# EAGLE design datalogger (EAGLE 8.3.2)
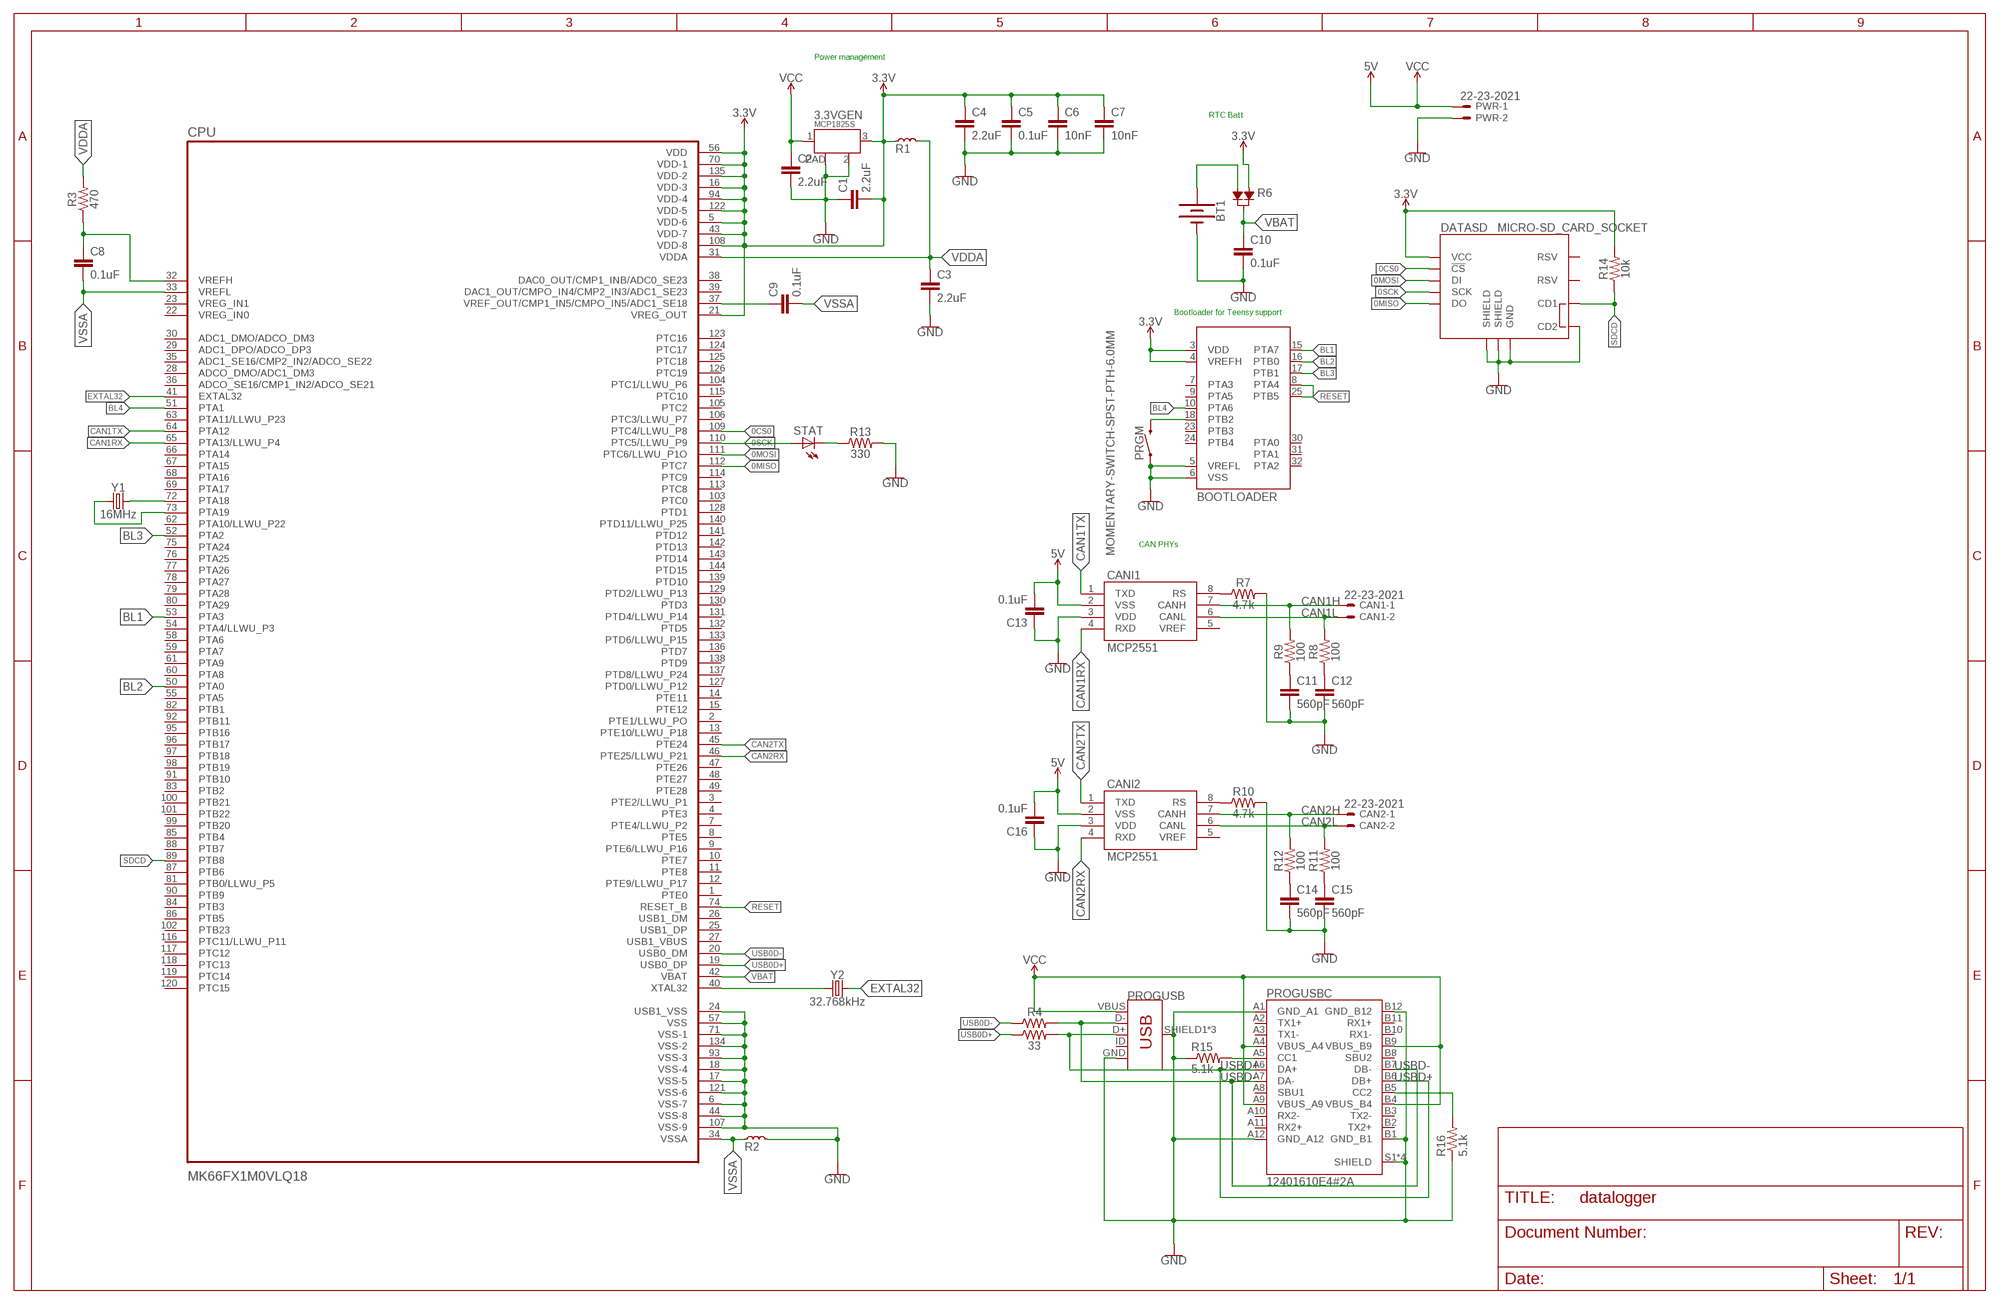
[diagram p0: schematic, sheet 1]

## Parts
3.3VGEN  MCP1825S  LDO  [SOT-223]
BOOTLOADER  MKL04Z32VLC4  [LQFP32-08]
BT1  BATTERY-20MM_SMD_4LEGS  [BATTCON_20MM_4LEGS]
C1  2.2uF  2.2UF-0603-10V-20%  [0603]
C2  2.2uF  2.2UF-0603-10V-20%  [0603]
C3  2.2uF  2.2UF-0603-10V-20%  [0603]
C4  2.2uF  2.2UF-0603-10V-20%  [0603]
C5  0.1uF  0.1UF-0603-25V-(+80/-20%)  [0603]
C6  10nF  10NF-0603-50V-10%  [0603]
C7  10nF  10NF-0603-50V-10%  [0603]
C8  0.1uF  0.1UF-0603-25V-(+80/-20%)  [0603]
C9  0.1uF  0.1UF-0603-25V-(+80/-20%)  [0603]
C10  0.1uF  0.1UF-0603-25V-(+80/-20%)  [0603]
C11  560pF  560PF-0603-50V-5%  [0603]
C12  560pF  560PF-0603-50V-5%  [0603]
C13  0.1uF  0.1UF-0603-25V-(+80/-20%)  [0603]
C14  560pF  560PF-0603-50V-5%  [0603]
C15  560pF  560PF-0603-50V-5%  [0603]
C16  0.1uF  0.1UF-0603-25V-(+80/-20%)  [0603]
CAN1  22-23-2021  [22-23-2021]
CAN2  22-23-2021  [22-23-2021]
CANI1  MCP2551  [SO08]
CANI2  MCP2551  [SO08]
CPU  MK66FX1M0VLQ18  [QFP50P2200X2200X160-144N]
DATASD  MICRO-SD_CARD_SOCKET  [MICRO-SD-SOCKET]
PRGM  MOMENTARY-SWITCH-SPST-PTH-6.0MM  [TACTILE_SWITCH_PTH_6.0MM]
PROGUSB  USB_MICRO-B_FEMALE-SMT  [USB-B-MICRO-SMD]
PROGUSBC  12401610E4#2A  [AMPHENOL_12401610E4#2A]
PWR  22-23-2021  [22-23-2021]
R1  FERRITE  [L0603]
R2  FERRITE  [L0603]
R3  470  470OHM-0603-1/10W-1%  [0603]
R4  33  33OHM-0603-1/10W-1%  [0603]
R5  33  33OHM-0603-1/10W-1%  [0603]
R6  DIODE_DUAL  [SOT-23]
R7  4.7k  4.7KOHM-0603-1/10W-1%  [0603]
R8  100  100OHM-0603-1/4W-5%  [0603]
R9  100  100OHM-0603-1/4W-5%  [0603]
R10  4.7k  4.7KOHM-0603-1/10W-1%  [0603]
R11  100  100OHM-0603-1/4W-5%  [0603]
R12  100  100OHM-0603-1/4W-5%  [0603]
R13  330  330OHM-0603-1/10W-1%  [0603]
R14  10k  10KOHM-0603-1/10W-1%  [0603]
R15  5.1k  R-US_R0603  [R0603]
R16  5.1k  R-US_R0603  [R0603]
STAT  LED5MM  [LED5MM]
Y1  16MHz  CRYSTAL-16MHZSMD-5X3.2  [CRYSTAL-SMD-5X3.2-4PAD]
Y2  32.768kHz  CRYSTAL-32.768KHZPTH-2X6  [CRYSTAL-PTH-2X6-CYL]

## Nets
0CS0: CPU.109(PTC4/LLWU_P8) DATASD.CS(!CS)
0MISO: CPU.112(PTC7) DATASD.DO
0MOSI: CPU.111(PTC6/LLWU_P1O) DATASD.DI
0SCK: CPU.110(PTC5/LLWU_P9) DATASD.SCLK(SCK) STAT.A
3.3V [THIC]: 3.3VGEN.3(OUT) BOOTLOADER.3(VDD) BOOTLOADER.4(VREFH) C1.2 C4.1 C5.1 C6.1 C7.1 CPU.5(VDD-6) CPU.16(VDD-3) CPU.21(VREG_OUT) CPU.43(VDD-7) CPU.56(VDD) CPU.70(VDD-1) CPU.94(VDD-4) CPU.108(VDD-8) CPU.122(VDD-5) CPU.135(VDD-2) DATASD.VCC R1.1 R6.2 R14.2
5V: C13.2 C16.2 CANI1.2(VSS) CANI2.2(VSS)
BL1: BOOTLOADER.15(PTA7) CPU.53(PTA3)
BL2: BOOTLOADER.16(PTB0) CPU.50(PTA0)
BL3: BOOTLOADER.17(PTB1) CPU.52(PTA2)
BL4: BOOTLOADER.10(PTA6) CPU.51(PTA1)
CAN1H: CAN1.1 CANI1.7(CANH) R9.2
CAN1L: CAN1.2 CANI1.6(CANL) R8.2
CAN1RX: CANI1.4(RXD) CPU.65(PTA13/LLWU_P4)
CAN1TX: CANI1.1(TXD) CPU.64(PTA12)
CAN2H: CAN2.1 CANI2.7(CANH) R12.2
CAN2L: CAN2.2 CANI2.6(CANL) R11.2
CAN2RX: CANI2.4(RXD) CPU.46(PTE25/LLWU_P21)
CAN2TX: CANI2.1(TXD) CPU.45(PTE24)
EXTAL32: CPU.41(EXTAL32) Y2.2
GND: 3.3VGEN.2(GND) 3.3VGEN.PAD BOOTLOADER.5(VREFL) BOOTLOADER.6(VSS) BT1.NEGATIVE(-) C1.1 C2.2 C3.2 C4.2 C5.2 C6.2 C7.2 C10.2 C11.2 C12.2 C13.1 C14.2 C15.2 C16.1 CANI1.3(VDD) CANI2.3(VDD) CPU.6(VSS-7) CPU.17(VSS-5) CPU.18(VSS-4) CPU.24(USB1_VSS) CPU.44(VSS-8) CPU.57(VSS) CPU.71(VSS-1) CPU.93(VSS-3) CPU.107(VSS-9) CPU.121(VSS-6) CPU.134(VSS-2) DATASD.CD2 DATASD.GND DATASD.GND1(SHIELD) DATASD.GND3(SHIELD) PRGM.1 PROGUSB.GND PROGUSB.SHIELD1(SHIELD) PROGUSB.SHIELD2(SHIELD) PROGUSB.SHIELD3(SHIELD) PROGUSBC.A1(GND_A1) PROGUSBC.A12(GND_A12) PROGUSBC.B1(GND_B1) PROGUSBC.B12(GND_B12) PROGUSBC.S1(SHIELD) PROGUSBC.S2(SHIELD) PROGUSBC.S3(SHIELD) PROGUSBC.S4(SHIELD) PWR.2 R2.2 R7.2 R10.2 R13.2 R15.1 R16.1
N$1: CPU.72(PTA18) Y1.3
N$2: CPU.73(PTA19) Y1.1
N$3: CPU.40(XTAL32) Y2.1
N$4: C9.1 CPU.37(VREF_OUT/CMP1_IN5/CMPO_IN5/ADC1_SE18)
N$8: R13.1 STAT.K(C)
N$9: PROGUSBC.A5(CC1) R15.2
N$10: BT1.POSITIVE@1(+) BT1.POSITIVE@2(+) BT1.POSITIVE@3(+) BT1.POSITIVE@4(+) R6.1
N$11: PROGUSBC.B5(CC2) R16.2
N$12: CANI1.8(RS) R7.1
N$13: C11.1 R9.1
N$14: C12.1 R8.1
N$19: CANI2.8(RS) R10.1
N$20: C14.1 R12.1
N$21: C15.1 R11.1
PRGM: BOOTLOADER.18(PTB2) PRGM.3
RESET: BOOTLOADER.8(PTA4) BOOTLOADER.25(PTB5) CPU.74(RESET_B)
SDCD: CPU.89(PTB8) DATASD.CD1 R14.1
USB0D+: CPU.19(USB0_DP) R5.1
USB0D-: CPU.20(USB0_DM) R4.1
USBD+: PROGUSB.D+ PROGUSBC.A6(DA+) PROGUSBC.B6(DB+) R5.2
USBD-: PROGUSB.D- PROGUSBC.A7(DA-) PROGUSBC.B7(DB-) R4.2
VBAT: C10.1 CPU.42(VBAT) R6.3
VCC: 3.3VGEN.1(IN) C2.1 PROGUSB.VBUS PROGUSBC.A4(VBUS_A4) PROGUSBC.A9(VBUS_A9) PROGUSBC.B4(VBUS_B4) PROGUSBC.B9(VBUS_B9) PWR.1 ; supply symbol labelled 5V
VDDA: C3.1 CPU.31(VDDA) R1.2 R3.2
VREFH: C8.1 CPU.32(VREFH) R3.1
VSSA: C8.2 C9.2 CPU.33(VREFL) CPU.34(VSSA) R2.1
Unconnected: BOOTLOADER.7(PTA3) BOOTLOADER.9(PTA5) BOOTLOADER.23(PTB3) BOOTLOADER.24(PTB4) BOOTLOADER.30(PTA0) BOOTLOADER.31(PTA1) BOOTLOADER.32(PTA2) CANI1.5(VREF) CANI2.5(VREF) CPU.1(PTE0) CPU.2(PTE1/LLWU_PO) CPU.3(PTE2/LLWU_P1) CPU.4(PTE3) CPU.7(PTE4/LLWU_P2) CPU.8(PTE5) CPU.9(PTE6/LLWU_P16) CPU.10(PTE7) CPU.11(PTE8) CPU.12(PTE9/LLWU_P17) CPU.13(PTE10/LLWU_P18) CPU.14(PTE11) CPU.15(PTE12) CPU.22(VREG_IN0) CPU.23(VREG_IN1) CPU.25(USB1_DP) CPU.26(USB1_DM) CPU.27(USB1_VBUS) CPU.28(ADCO_DMO/ADC1_DM3) CPU.29(ADC1_DPO/ADCO_DP3) CPU.30(ADC1_DMO/ADCO_DM3) CPU.35(ADC1_SE16/CMP2_IN2/ADCO_SE22) CPU.36(ADCO_SE16/CMP1_IN2/ADCO_SE21) CPU.38(DAC0_OUT/CMP1_INB/ADC0_SE23) CPU.39(DAC1_OUT/CMPO_IN4/CMP2_IN3/ADC1_SE23) CPU.47(PTE26) CPU.48(PTE27) CPU.49(PTE28) CPU.54(PTA4/LLWU_P3) CPU.55(PTA5) CPU.58(PTA6) CPU.59(PTA7) CPU.60(PTA8) CPU.61(PTA9) CPU.62(PTA10/LLWU_P22) CPU.63(PTA11/LLWU_P23) CPU.66(PTA14) CPU.67(PTA15) CPU.68(PTA16) CPU.69(PTA17) CPU.75(PTA24) CPU.76(PTA25) CPU.77(PTA26) CPU.78(PTA27) CPU.79(PTA28) CPU.80(PTA29) CPU.81(PTB0/LLWU_P5) CPU.82(PTB1) CPU.83(PTB2) CPU.84(PTB3) CPU.85(PTB4) CPU.86(PTB5) CPU.87(PTB6) CPU.88(PTB7) CPU.90(PTB9) CPU.91(PTB10) CPU.92(PTB11) CPU.95(PTB16) CPU.96(PTB17) CPU.97(PTB18) CPU.98(PTB19) CPU.99(PTB20) CPU.100(PTB21) CPU.101(PTB22) CPU.102(PTB23) CPU.103(PTC0) CPU.104(PTC1/LLWU_P6) CPU.105(PTC2) CPU.106(PTC3/LLWU_P7) CPU.113(PTC8) CPU.114(PTC9) CPU.115(PTC10) CPU.116(PTC11/LLWU_P11) CPU.117(PTC12) CPU.118(PTC13) CPU.119(PTC14) CPU.120(PTC15) CPU.123(PTC16) CPU.124(PTC17) CPU.125(PTC18) CPU.126(PTC19) CPU.127(PTD0/LLWU_P12) CPU.128(PTD1) CPU.129(PTD2/LLWU_P13) CPU.130(PTD3) CPU.131(PTD4/LLWU_P14) CPU.132(PTD5) CPU.133(PTD6/LLWU_P15) CPU.136(PTD7) CPU.137(PTD8/LLWU_P24) CPU.138(PTD9) CPU.139(PTD10) CPU.140(PTD11/LLWU_P25) CPU.141(PTD12) CPU.142(PTD13) CPU.143(PTD14) CPU.144(PTD15) DATASD.RSV1(RSV) DATASD.RSV2(RSV) PROGUSB.ID PROGUSBC.A2(TX1+) PROGUSBC.A3(TX1-) PROGUSBC.A8(SBU1) PROGUSBC.A10(RX2-) PROGUSBC.A11(RX2+) PROGUSBC.B2(TX2+) PROGUSBC.B3(TX2-) PROGUSBC.B8(SBU2) PROGUSBC.B10(RX1-) PROGUSBC.B11(RX1+)

## Notes on the sheet
- Power management
- RTC Batt
- Bootloader for Teensy support
- CAN PHYs

## Library data of the parts
3.3VGEN = t32_ref:LDO; DESC: 3.3V 500mA; MF: Microchip Technology; MPN: MCP1825S-3302E/DB; OC_MOUSER: 579-MCP1825S-3302EDB; PACKAGE: SOT-223-3; TYPE: Voltage regulator
BOOTLOADER = t32_ref:MKL04Z32VLC4; DESC: MKL04Z32VLC4 (preprogrammed); MF: PJRC; MPN: IC_MKL04Z32_TQFP32; PACKAGE: LQFP-32; TYPE: Microcontroller
BT1 = SparkFun-Batteries:BATTERY: Battery - Single Cell A variety of battery chemistries, sizes, and footprints. Device List: 20MM_PTH - Coin Cell Battery Holder - 20mm (PTH) <https://www.sparkfun.com/products/783> 6.8MM_PTH - Coin Cell Battery Holder - 6.8MM(SMD) <https://www.digikey.com/product-detail/en/seiko-instruments/MS621FE-FL11E/728-1057-ND/1889208?WT.srch=1&gclid=CNOQ5a6LzdQCFZS2wAodXCkE0g> 12MM_SMD - Coin Cell Battery Holder - 12mm (SMD) <https://www.sparkfun.com/products/10592> 12MM_PTH - Coin Cell Battery Holder - 12mm (PTH) <https://www.sparkfun.com/products/7948> 20MM_SMD - 20mm Coin Cell Battery Holder (SMD) (2 legs) Used on the Big Time Watch Kit <https://www.sparkfun.com/products/11734> 20MM_SMD_4LEGS - Coin Cell Battery Holder - 20mm (SMD) <https://www.sparkfun.com/products/11892> 20MM_SMD_4LEGS_OVERPASTE - Coin Cell Battery Holder - 20mm (SMD) <https://www.sparkfun.com/products/11892> (Over-paste on the legs) 24.5MM_PTH - Coin Cell Battery Holder - 24.5mm (PTH) <https://www.sparkfun.com/products/8863> 9V - 9V Battery Holder - PC Mount Used on the SparkFun SparkPunk Sound Kit <https://www.sparkfun.com/products/11177> and SparkFun SparkPunk Sequencer Kit <https://www.sparkfun.com/products/12707> 18650 - Battery Holder - 18650 (PTH) <https://www.sparkfun.com/products/13113> AA - Battery Holder - 1xAA (PTH) <https://www.sparkfun.com/products/7949> AAA - Battery Holder - 1xAAA (PTH) <https://www.sparkfun.com/products/12718> AA_KIT - Battery Holder - 1xAA (PTH) <https://www.sparkfun.com/products/7949> Special kit package - pads only have exposed copper on one side of the board. AAA_KIT - Battery Holder - 1xAAA (PTH) <https://www.sparkfun.com/products/12718> Special kit package - pads only have exposed copper on one side of the board.; PROD_ID: BATT-10373; SF_SKU: PRT-11892
C1-C4 = SparkFun-Capacitors:2.2UF: 2.2µF ceramic capacitors A capacitor is a passive two-terminal electrical component used to store electrical energy temporarily in an electric field.; PROD_ID: CAP-07888
C5 C8-C10 C13 C16 = SparkFun-Capacitors:0.1UF: 0.1µF ceramic capacitors A capacitor is a passive two-terminal electrical component used to store electrical energy temporarily in an electric field.; PROD_ID: CAP-00810
C6 C7 = SparkFun-Capacitors:10NF: 0.01uF/10nF/10,000pF ceramic capacitors A capacitor is a passive two-terminal electrical component used to store electrical energy temporarily in an electric field. CAP-09321; PROD_ID: CAP-00867
C11 C12 C14 C15 = SparkFun-Capacitors:560PF: 0.56nF/560pF ceramic capacitors A capacitor is a passive two-terminal electrical component used to store electrical energy temporarily in an electric field.; PROD_ID: CAP-08749
CAN1 CAN2 PWR = con-molex:22-23-2021: .100" (2.54mm) Center Header - 2 Pin; MF: MOLEX; MPN: 22-23-2021; OC_FARNELL: 1462926; OC_NEWARK: 25C3832
CANI1 CANI2 = SparkFun-IC-Comms:MCP2551: MCP2551 High Speed CAN Transceiver High speed CAN transceiver Datasheet <http://www.sparkfun.com/datasheets/DevTools/Arduino/MCP2551.pdf> SparkFun Products CAN-BUS Shield <https://www.sparkfun.com/products/13262> (DEV-13262) SparkFun OBD-II UART <https://www.sparkfun.com/products/9555> (WIG-09555); PROD_ID: IC-09907
CPU = MK66FX1M0VLQ18:MK66FX1M0VLQ18: Kinetis K66: 180MHz Cortex-M4F MCU, 1.2MB Flash, 256KB SRAM, 2xUSB, Ethernet, 144-LQFP Operating Characteristics Parameter Value Core Type Arm Cortex-M4 Operating Frequency [Max (MHz)] 180 SRAM (kB) 256 Flash (kB) 1024 EEPROM (kB) 4 UART 6 SPI 3 <th data-dtmsubaction="Part Details: Operating Characteristics Section: I2C Link Click" data-dtmaction="Part Details: Operating Characteristics Section: I2C Link Click" data-content-subfinding="Operating Characteristics Section" class="dtmcustomrulelink"> I2C data-dtmsubaction="Part Details: Operating Characteristics Section: I2C Link Click" data-dtmaction="Part Details: Operating Characteristics Section: I2C Link Click" data-content-subfinding="Operating Characteristics Section" class="dtmcustomrulelink">4 <th data-dtmsubaction="Part Details: Operating Characteristics Section: I2S Link Click" data-dtmaction="Part Details: Operating Characteristics Section: I2S Link Click" data-content-subfinding="Operating Characteristics Section" class="dtmcustomrulelink"> I2S data-dtmsubaction="Part Details: Operating Characteristics Section: I2S Link Click" data-dtmaction="Part Details: Operating Characteristics Section: I2S Link Click" data-content-subfinding="Operating Characteristics Section" class="dtmcustomrulelink">1 USB Controllers 2 CAN 2 Ethernet 1 GPIO 100 ADC (16 bit) 2 DAC (12-bit) 2 16-bit PWM 24 16-bit Timer 25 32-bit Timer 4 Other analog blocks voltage reference Security CA, CRC, RNG Human Machine Interface touch system interface Supply voltage [min] (V) 1.71 Supply voltage [max] (V) 3.6 Ambient Operating Temperature (Min-Max) (℃) -40 to 105 Manufacturer <https://www.nxp.com/part/MK66FX1M0VLQ18>; MANUFACTURER: NXP USA; PACKAGE: QFP50P2200X2200X160-144N
DATASD = SparkFun-Connectors:MICRO-SD_CARD_SOCKET: microSD Socket for Transflash Push-push type µSD socket. tDoc lines correctly indicate media card edge positions when inserting (unlocked, locked, depressed). NOTE: CD1 and CD2 are connected internally, and the default detect state of the socket is detect pin to ground. SparkFun Products: WAV Trigger <https://www.sparkfun.com/products/13660> CAN-Bus Shield <https://www.sparkfun.com/products/13262> SparkFun Level Shifing microSD Breakout <https://www.sparkfun.com/products/13743>; PROD_ID: CONN-07820; SF_ID: PRT-00127
PRGM = SparkFun-Switches:MOMENTARY-SWITCH-SPST: Momentary Switch (Pushbutton) - SPST Normally-open (NO) SPST momentary switches (buttons, pushbuttons). Variants PTH-12MM - 12mm square, through-hole Momentary Pushbutton Switch - 12mm Square <https://www.sparkfun.com/products/9190> (COM-09190) PTH-6.0MM, PTH-6.0MM-KIT - 6.0mm square, through-hole Mini Pushbutton Switch <https://www.sparkfun.com/products/97> (COM-00097) KIT package intended for soldering kit's - only one side of pads' copper is exposed. PTH-RIGHT-ANGLE-KIT - Right-angle, through-hole Right Angle Tactile Button <https://www.sparkfun.com/products/10791> - Used on SparkFun BigTime Watch Kit <https://www.sparkfun.com/products/11734> SMD-12MM - 12mm square, surface-mount Tactile Button - SMD (12mm) <https://www.sparkfun.com/products/12993> (COM-12993) Used on SparkFun PicoBoard <https://www.sparkfun.com/products/11888> SMD-4.5MM - 4.5mm Square Trackball Switch Used on SparkFun Blackberry Trackballer Breakout <https://www.sparkfun.com/products/13169> SMD-4.6MMX2.8MM - 4.60mm x 2.80mm, surface mount Used on SparkFun SAMD21 Mini Breakout <https://www.sparkfun.com/products/13664> SMD-5.2MM, SMD-5.2-REDUNDANT - 5.2mm square, surface-mount Mini Pushbutton Switch - SMD <https://www.sparkfun.com/products/8720> (COM-08720) Used on Arduino Pro Mini <https://www.sparkfun.com/products/11114> REDUNDANT package connects both switch circuits together SMD-6.0X3.5MM - 6.0 x 3.5mm, surface mount Momentary Reset Switch SMD <https://www.sparkfun.com/products/8229> (COM-08229) SMD-6.2MM-TALL - 6.2mm square, surface mount Tactile Button - SMD (6mm) <https://www.sparkfun.com/products/12992> Used on SparkFun Digital Sandbox <https://www.sparkfun.com/products/12651> SMD-RIGHT-ANGLE - Right-angle, surface mount Used on SparkFun Block for Intel® Edison - Arduino <https://www.sparkfun.com/products/13036>; PROD_ID: SWCH-08441; SF_SKU: COM-00097
PROGUSB = SparkFun-Connectors:USB_MICRO-B: USB Type Micro-B Connector Male/female and PTH/SMT variants SparkFun Products: SparkFun microB USB Breakout <https://www.sparkfun.com/products/12035> SparkFun USB microB Plug Breakout <https://www.sparkfun.com/products/10031> SparkFun ESP8266 Thing <https://www.sparkfun.com/products/13231>; PROD_ID: CONN-11752
PROGUSBC = 12401610E4_2A:12401610E4#2A: Usb Type-c, Ra Rcpt, Pcb Mount,; DESCRIPTION: Conn USB Type C Surface Mount Receptacle; DIGI-KEY_PART_NUMBER: 12401610E4#2ACT-ND; DIGI-KEY_PURCHASE_URL: https://www.digikey.com/product-detail/en/amphenol-icc-commercial-products/12401610E4-2A/12401610E4-2ACT-ND/5775520?utm_source=snapeda&utm_medium=aggregator&utm_campaign=symbol; MF: Amphenol ICC; MP: 12401610E4#2A; PACKAGE: None
R1 R2 = t32_ref:FERRITE; DESC: 600R / 100MHz; MF: Murata Electronics; MPN: BLM18AG601SN1D; OC_MOUSER: 81-BLM11A601S; PACKAGE: 0603; TYPE: Ferrite
R3 = SparkFun-Resistors:470OHM: 470Ω resistor A resistor is a passive two-terminal electrical component that implements electrical resistance as a circuit element. Resistors act to reduce current flow, and, at the same time, act to lower voltage levels within circuits. - Wikipedia; PROD_ID: RES-07869
R4 R5 = SparkFun-Resistors:33OHM: 33Ω resistor A resistor is a passive two-terminal electrical component that implements electrical resistance as a circuit element. Resistors act to reduce current flow, and, at the same time, act to lower voltage levels within circuits. - Wikipedia; PROD_ID: RES-08270
R6 = t32_ref:DIODE_DUAL; DESC: Dual Schottky, common cat; MF: NXP Semiconductors; MPN: BAT54C,215; OC_MOUSER: 771-BAT54C-T/R; PACKAGE: SOT-23; TYPE: Diode
R7 R10 = SparkFun-Resistors:4.7KOHM: 4.7kΩ resistor A resistor is a passive two-terminal electrical component that implements electrical resistance as a circuit element. Resistors act to reduce current flow, and, at the same time, act to lower voltage levels within circuits. - Wikipedia; PROD_ID: RES-07857
R8 R9 R11 R12 = SparkFun-Resistors:100OHM: 100Ω resistor A resistor is a passive two-terminal electrical component that implements electrical resistance as a circuit element. Resistors act to reduce current flow, and, at the same time, act to lower voltage levels within circuits. - Wikipedia; PROD_ID: RES-12438
R13 = SparkFun-Resistors:330OHM: 330Ω resistor A resistor is a passive two-terminal electrical component that implements electrical resistance as a circuit element. Resistors act to reduce current flow, and, at the same time, act to lower voltage levels within circuits. - Wikipedia; PROD_ID: RES-00818
R14 = SparkFun-Resistors:10KOHM: 10kΩ resistor A resistor is a passive two-terminal electrical component that implements electrical resistance as a circuit element. Resistors act to reduce current flow, and, at the same time, act to lower voltage levels within circuits. - Wikipedia; PROD_ID: RES-00824
R15 R16 = rcl:R-US_: RESISTOR, American symbol; SPICEPREFIX: R
STAT = led:LED: LED OSRAM: - CHIPLED LG R971, LG N971, LY N971, LG Q971, LY Q971, LO R971, LY R971 LH N974, LH R974 LS Q976, LO Q976, LY Q976 LO Q996 - Hyper CHIPLED LW Q18S LB Q993, LB Q99A, LB R99A - SideLED LS A670, LO A670, LY A670, LG A670, LP A670 LB A673, LV A673, LT A673, LW A673 LH A674 LY A675 LS A676, LA A676, LO A676, LY A676, LW A676 LS A679, LY A679, LG A679 - Hyper Micro SIDELED® LS Y876, LA Y876, LO Y876, LY Y876 LT Y87S - SmartLED LW L88C, LW L88S LB L89C, LB L89S, LG L890 LS L89K, LO L89K, LY L89K LS L896, LA L896, LO L896, LY L896 - TOPLED LS T670, LO T670, LY T670, LG T670, LP T670 LSG T670, LSP T670, LSY T670, LOP T670, LYG T670 LG T671, LOG T671, LSG T671 LB T673, LV T673, LT T673, LW T673 LH T674 LS T676, LA T676, LO T676, LY T676, LB T676, LH T676, LSB T676, LW T676 LB T67C, LV T67C, LT T67C, LS T67K, LO T67K, LY T67K, LW E67C LS E67B, LA E67B, LO E67B, LY E67B, LB E67C, LV E67C, LT E67C LW T67C LS T679, LY T679, LG T679 LS T770, LO T770, LY T770, LG T770, LP T770 LB T773, LV T773, LT T773, LW T773 LH T774 LS E675, LA E675, LY E675, LS T675 LS T776, LA T776, LO T776, LY T776, LB T776 LHGB T686 LT T68C, LB T68C - Hyper Mini TOPLED® LB M676 - Mini TOPLED Santana® LG M470 LS M47K, LO M47K, LY M47K Source: http://www.osram.convergy.de LUXEON: - LUMILED® LXK2-PW12-R00, LXK2-PW12-S00, LXK2-PW14-U00, LXK2-PW14-V00 LXK2-PM12-R00, LXK2-PM12-S00, LXK2-PM14-U00 LXK2-PE12-Q00, LXK2-PE12-R00, LXK2-PE12-S00, LXK2-PE14-T00, LXK2-PE14-U00 LXK2-PB12-K00, LXK2-PB12-L00, LXK2-PB12-M00, LXK2-PB14-N00, LXK2-PB14-P00, LXK2-PB14-Q00 LXK2-PR12-L00, LXK2-PR12-M00, LXK2-PR14-Q00, LXK2-PR14-R00 LXK2-PD12-Q00, LXK2-PD12-R00, LXK2-PD12-S00 LXK2-PH12-R00, LXK2-PH12-S00 LXK2-PL12-P00, LXK2-PL12-Q00, LXK2-PL12-R00 Source: www.luxeon.com KINGBRIGHT: KA-3528ASYC Source: www.kingbright.com
Y1 = SparkFun-Clocks:CRYSTAL-16MHZ: 16MHz Crystal Digikey Example <http://www.digikey.com/product-search/en?keywords=535-9122-1-ND> Frequency: 16MHz Frequency Stability: ±50ppm Frequency Tolerance: ±20ppm Load Capacitance: 18pF SparkFun Products: Pro Micro -5V/16MHz <https://www.sparkfun.com/products/12640> SparkFun Serial Enabled LCD Kit <https://www.sparkfun.com/products/10097>; PROD_ID: XTAL-08218; SF_ID: COM-00094
Y2 = SparkFun-Clocks:CRYSTAL-32.768KHZ: 32.768kHz Crystal Frequency: 32.768kHz Frequency Stability: ±20ppm Load Capacitance: 12.5pF (PTH-2X6 & SMD-3.2X1.5), 6pF (SMD-2X6) SparkFun Products: SparkFun BigTime Watch Kit <https://www.sparkfun.com/products/11734> SparkFun nRF52832 Breakout <https://www.sparkfun.com/products/13990> SparkFun Real Time Clock Module <https://www.sparkfun.com/products/12708>; PROD_ID: XTAL-10112

## Net classes
1 THICC: width 0.406 mm
2 THIC: width 0.279 mm

## Board
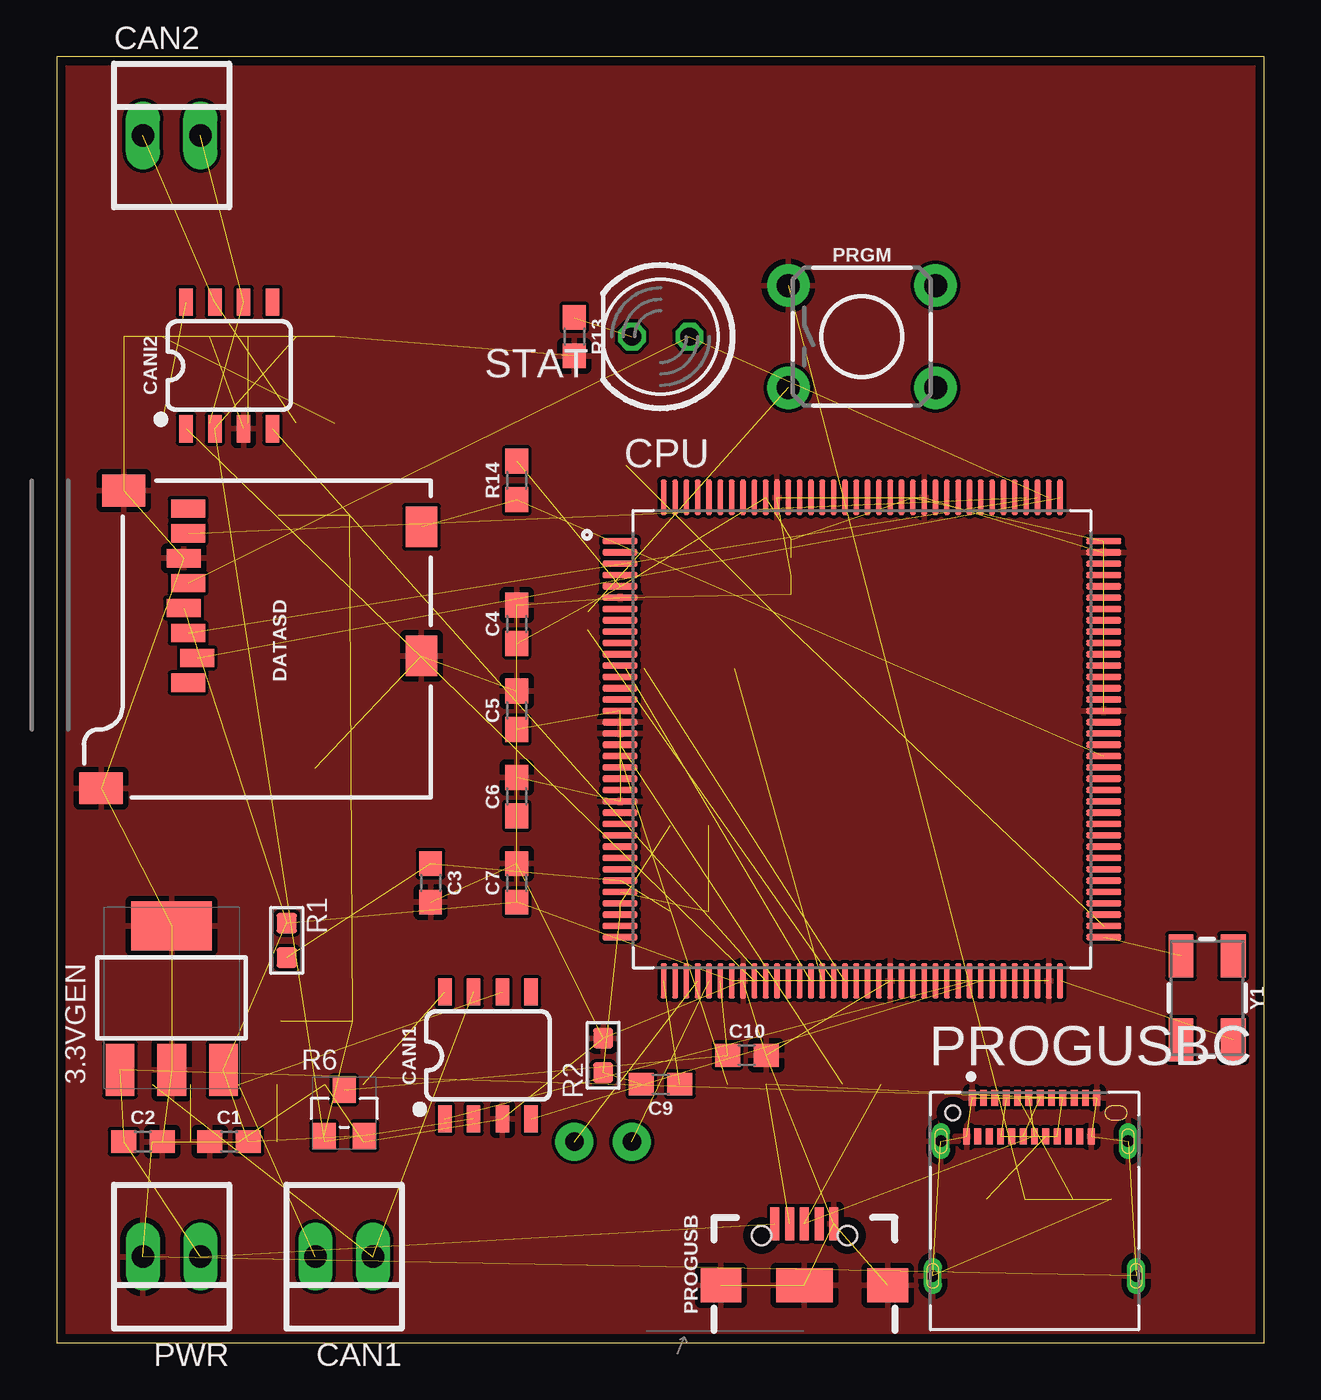
[diagram p1: board, top side]
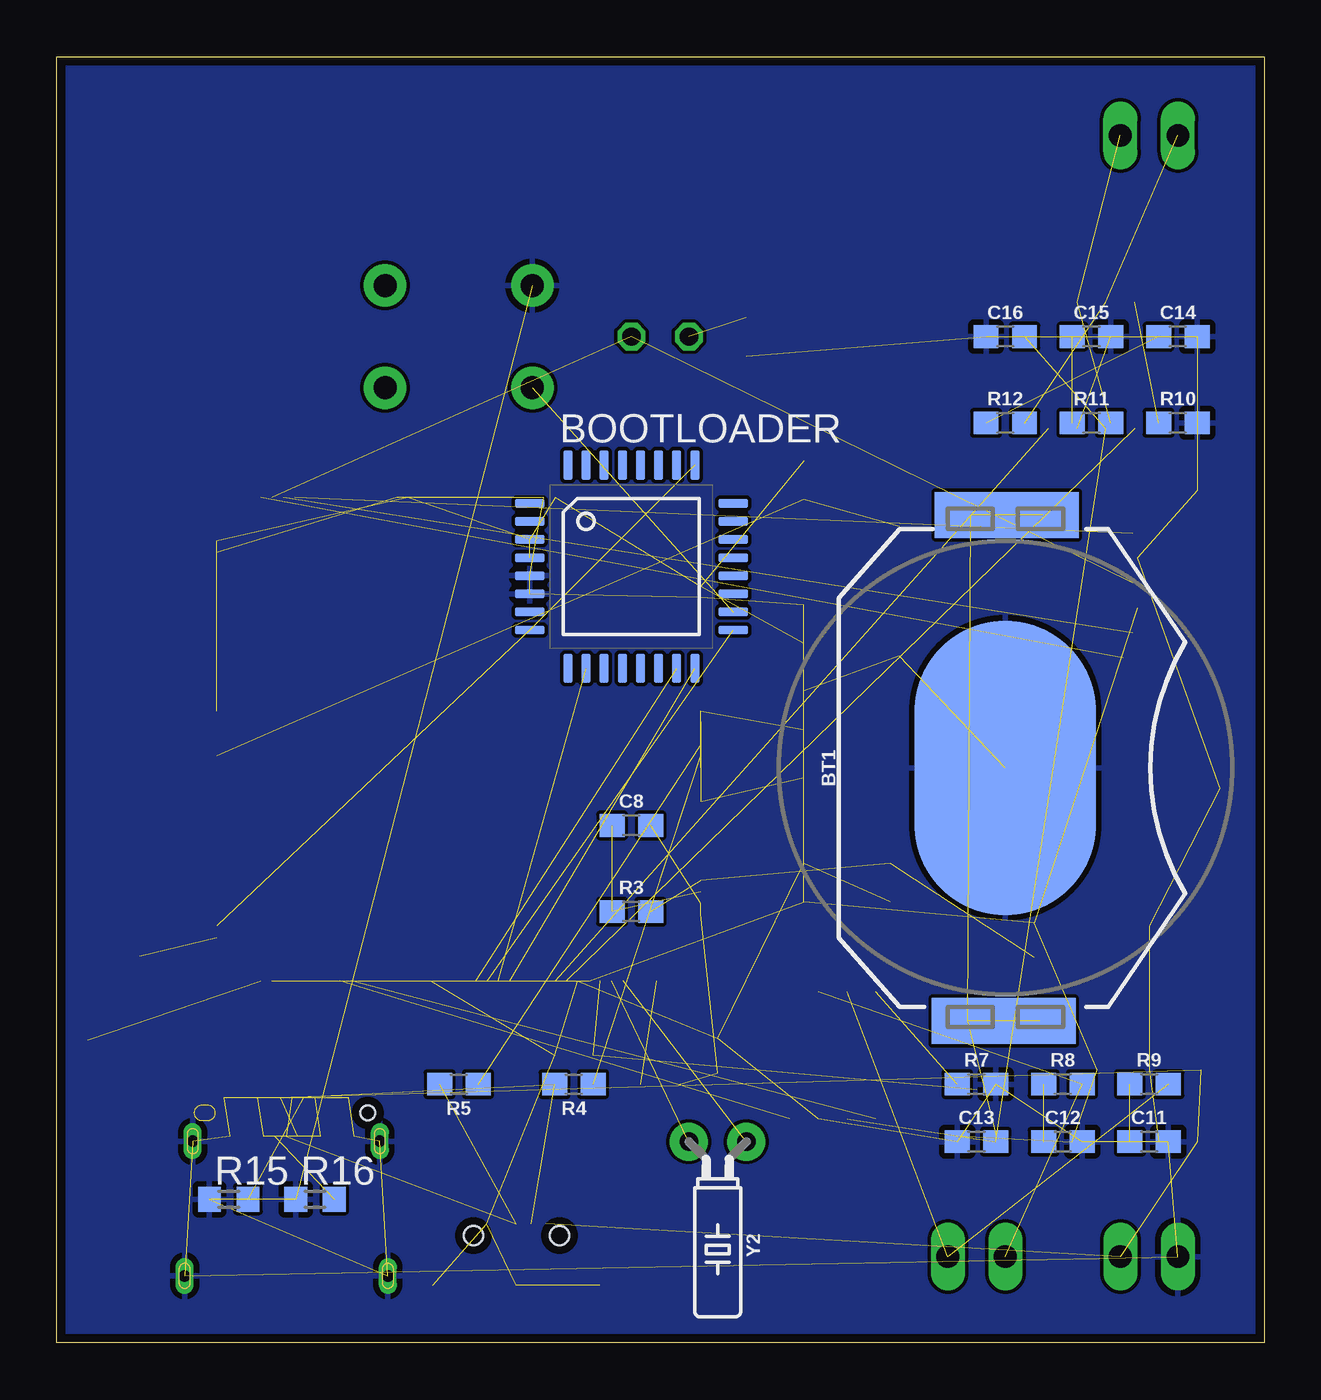
[diagram p2: board, bottom side, seen from below]

Size 53.32 x 56.82 mm. Coordinates in mm from the lower left corner, seen from the top.
Outline: 0,0 53.32,0 53.32,56.82 0,56.82 0,0
Copper layers (1*16): Top 0.035559375mm / dielectric 1.6mm / Bottom 0.035559375mm
Design rules "oshpark-2layer": minimum track width 6mil, minimum drill 10mil, track to track 6mil, track to pad 6mil, pad to pad 6mil, via to via 6mil, smd to smd 6mil, copper to edge 15mil, drill to drill 6mil, minimum pad ring 5mil, minimum via ring 5mil, stop-mask expansion 2.5mil, vias tented up to drill 0mil, thermal gap 10mil

### Footprints (pad centres in the part's own frame; a part is rotated, then mirrored left to right if it is on the bottom)
SOT-223 = smd 1.27 x 2.286: 1 -2.286,-3.175; 2 0,-3.175; 3 2.286,-3.175 | smd 3.556 x 2.159: PAD 0,3.175
LQFP32-08 = smd 1.3 x 0.4: 1 -4.493,2.8; 2 -4.493,2; 3 -4.493,1.2; 4 -4.493,0.4; 5 -4.493,-0.4; 6 -4.493,-1.2; 7 -4.493,-2; 8 -4.493,-2.8; 17 4.493,-2.8; 18 4.493,-2; 19 4.493,-1.2; 20 4.493,-0.4; 21 4.493,0.4; 22 4.493,1.2; 23 4.493,2; 24 4.493,2.8 | smd 0.4 x 1.3: 9 -2.8,-4.493; 10 -2,-4.493; 11 -1.2,-4.493; 12 -0.4,-4.493; 13 0.4,-4.493; 14 1.2,-4.493; 15 2,-4.493; 16 2.8,-4.493; 25 2.8,4.493; 26 2,4.493; 27 1.2,4.493; 28 0.4,4.493; 29 -0.4,4.493; 30 -1.2,4.493; 31 -2,4.493; 32 -2.8,4.493
BATTCON_20MM_4LEGS = smd 13 x 8: NEGATIVE 0,0 | smd 2.032 x 3.175: POSITIVE@1 -11.176,1.651; POSITIVE@2 -11.176,-1.524; POSITIVE@3 11.176,1.524; POSITIVE@4 11.176,-1.651
0603 = smd 1.1 x 1: 1 -0.85,0; 2 0.85,0
22-23-2021 = drill 1 long: 1 -1.27,0; 2 1.27,0
SO08 = smd 0.6 x 1.2: 1 -1.905,-2.8; 2 -0.635,-2.8; 3 0.635,-2.8; 4 1.905,-2.8; 5 1.905,2.8; 6 0.635,2.8; 7 -0.635,2.8; 8 -1.905,2.8
QFP50P2200X2200X160-144N = smd 1.56 x 0.28: 1 -10.68,8.75; 2 -10.68,8.25; 3 -10.68,7.75; 4 -10.68,7.25; 5 -10.68,6.75; 6 -10.68,6.25; 7 -10.68,5.75; 8 -10.68,5.25; 9 -10.68,4.75; 10 -10.68,4.25; 11 -10.68,3.75; 12 -10.68,3.25; 13 -10.68,2.75; 14 -10.68,2.25; 15 -10.68,1.75; 16 -10.68,1.25; 17 -10.68,0.75; 18 -10.68,0.25; 19 -10.68,-0.25; 20 -10.68,-0.75; 21 -10.68,-1.25; 22 -10.68,-1.75; 23 -10.68,-2.25; 24 -10.68,-2.75; 25 -10.68,-3.25; 26 -10.68,-3.75; 27 -10.68,-4.25; 28 -10.68,-4.75; 29 -10.68,-5.25; 30 -10.68,-5.75; 31 -10.68,-6.25; 32 -10.68,-6.75; 33 -10.68,-7.25; 34 -10.68,-7.75; 35 -10.68,-8.25; 36 -10.68,-8.75; 73 10.68,-8.75; 74 10.68,-8.25; 75 10.68,-7.75; 76 10.68,-7.25; 77 10.68,-6.75; 78 10.68,-6.25; 79 10.68,-5.75; 80 10.68,-5.25; 81 10.68,-4.75; 82 10.68,-4.25; 83 10.68,-3.75; 84 10.68,-3.25; 85 10.68,-2.75; 86 10.68,-2.25; 87 10.68,-1.75; 88 10.68,-1.25; 89 10.68,-0.75; 90 10.68,-0.25; 91 10.68,0.25; 92 10.68,0.75; 93 10.68,1.25; 94 10.68,1.75; 95 10.68,2.25; 96 10.68,2.75; 97 10.68,3.25; 98 10.68,3.75; 99 10.68,4.25; 100 10.68,4.75; 101 10.68,5.25; 102 10.68,5.75; 103 10.68,6.25; 104 10.68,6.75; 105 10.68,7.25; 106 10.68,7.75; 107 10.68,8.25; 108 10.68,8.75 | smd 0.28 x 1.56: 37 -8.75,-10.68; 38 -8.25,-10.68; 39 -7.75,-10.68; 40 -7.25,-10.68; 41 -6.75,-10.68; 42 -6.25,-10.68; 43 -5.75,-10.68; 44 -5.25,-10.68; 45 -4.75,-10.68; 46 -4.25,-10.68; 47 -3.75,-10.68; 48 -3.25,-10.68; 49 -2.75,-10.68; 50 -2.25,-10.68; 51 -1.75,-10.68; 52 -1.25,-10.68; 53 -0.75,-10.68; 54 -0.25,-10.68; 55 0.25,-10.68; 56 0.75,-10.68; 57 1.25,-10.68; 58 1.75,-10.68; 59 2.25,-10.68; 60 2.75,-10.68; 61 3.25,-10.68; 62 3.75,-10.68; 63 4.25,-10.68; 64 4.75,-10.68; 65 5.25,-10.68; 66 5.75,-10.68; 67 6.25,-10.68; 68 6.75,-10.68; 69 7.25,-10.68; 70 7.75,-10.68; 71 8.25,-10.68; 72 8.75,-10.68; 109 8.75,10.68; 110 8.25,10.68; 111 7.75,10.68; 112 7.25,10.68; 113 6.75,10.68; 114 6.25,10.68; 115 5.75,10.68; 116 5.25,10.68; 117 4.75,10.68; 118 4.25,10.68; 119 3.75,10.68; 120 3.25,10.68; 121 2.75,10.68; 122 2.25,10.68; 123 1.75,10.68; 124 1.25,10.68; 125 0.75,10.68; 126 0.25,10.68; 127 -0.25,10.68; 128 -0.75,10.68; 129 -1.25,10.68; 130 -1.75,10.68; 131 -2.25,10.68; 132 -2.75,10.68; 133 -3.25,10.68; 134 -3.75,10.68; 135 -4.25,10.68; 136 -4.75,10.68; 137 -5.25,10.68; 138 -5.75,10.68; 139 -6.25,10.68; 140 -6.75,10.68; 141 -7.25,10.68; 142 -7.75,10.68; 143 -8.25,10.68; 144 -8.75,10.68
MICRO-SD-SOCKET = smd 1.8 x 1.4: CD1 -2.05,0.4; CD2 -7.75,0.4 | smd 0.8 x 1.5: CS -7.84,10.3; DI -6.74,10.7; DO -2.34,10.7; GND -3.44,10.9; RSV1 -8.94,10.7; RSV2 -1.24,10.7; SCLK -4.54,10.7; VCC -5.64,10.9 | smd 1.4 x 1.9: GND1 -13.6,14.55; GND3 -0.45,13.55
TACTILE_SWITCH_PTH_6.0MM = drill 1.016 pad 1.88: 1 -3.251,2.261; 2 3.251,2.261; 3 -3.251,-2.261; 4 3.251,-2.261
USB-B-MICRO-SMD = smd 1.45 x 0.4: D+ 2.725,0; D- 2.725,0.65; GND 2.725,-1.3; ID 2.725,-0.65; VBUS 2.725,1.3 | smd 1.5 x 1.8: SHIELD1 0,3.685; SHIELD2 0,-3.685 | smd 1.5 x 2.5: SHIELD3 0,0 | hole 0.85: 2.2,1.9; 2.2,-1.9
AMPHENOL_12401610E4#2A = smd 0.3 x 0.7: A1 -2.75,0.66; A2 -2.25,0.66; A3 -1.75,0.66; A4 -1.25,0.66; A5 -0.75,0.66; A6 -0.25,0.66; A7 0.25,0.66; A8 0.75,0.66; A9 1.25,0.66; A10 1.75,0.66; A11 2.25,0.66; A12 2.75,0.66; B1 2.5,-1.04; B2 2,-1.04; B3 1.5,-1.04; B4 1,-1.04; B5 0.5,-1.04; B6 0,-1.04; B7 -0.5,-1.04; B8 -1,-1.04; B9 -1.5,-1.04; B10 -2,-1.04; B11 -2.5,-1.04; B12 -3,-1.04 | drill 0.5 pad 0.8 long: S1 -4.13,-1.25; S2 4.13,-1.25; S3 4.49,-7.2; S4 -4.49,-7.2 | hole 0.65: -3.6,0
L0603 = smd 0.889 x 0.889: 1 -0.762,0; 2 0.762,0
SOT-23 = smd 1.016 x 1.143: 1 -0.889,-1.016; 2 0.889,-1.016; 3 0,1.016
R0603 = smd 1 x 1.1: 1 -0.85,0; 2 0.85,0
LED5MM = drill 0.813 octagon: A -1.27,0; K 1.27,0
CRYSTAL-SMD-5X3.2-4PAD = smd 1.9 x 1.1: 1 -1.85,-1.15; 2 1.85,-1.15; 3 1.85,1.15; 4 -1.85,1.15
CRYSTAL-PTH-2X6-CYL = drill 0.813 pad 1.676: 1 -1.27,0; 2 1.27,0

### Placement (x,y rotation side)
3.3VGEN  5.08,15.24 0 top
BOOTLOADER  27.94,34.29 0 bottom
BT1  11.43,25.4 90 bottom
C1  7.62,8.89 0 top
C2  3.81,8.89 0 top
C3  16.51,20.32 270 top
C4  20.32,31.75 90 top
C5  20.32,27.94 90 top
C6  20.32,24.13 90 top
C7  20.32,20.32 90 top
C8  27.94,22.86 0 bottom
C9  26.67,11.43 180 top
C10  30.48,12.7 0 top
C11  5.08,8.89 0 bottom
C12  8.89,8.89 0 bottom
C13  12.7,8.89 0 bottom
C14  3.81,44.45 0 bottom
C15  7.62,44.45 0 bottom
C16  11.43,44.45 0 bottom
CAN1  12.7,3.81 180 top
CAN2  5.08,53.34 0 top
CANI1  19.05,12.7 0 top
CANI2  7.62,43.18 0 top
CPU  35.56,26.67 0 top
DATASD  16.51,38.1 90 top
PRGM  35.56,44.45 0 top
PROGUSB  33.02,2.54 90 top
PROGUSBC  43.18,10.16 0 top
PWR  5.08,3.81 180 top
R1  10.16,17.78 270 top
R2  24.13,12.7 90 top
R3  27.94,19.05 0 bottom
R4  30.48,11.43 180 bottom
R5  35.56,11.43 180 bottom
R6  12.7,10.16 0 top
R7  12.7,11.43 0 bottom
R8  8.89,11.43 0 bottom
R9  5.08,11.43 0 bottom
R10  3.81,40.64 0 bottom
R11  7.62,40.64 0 bottom
R12  11.43,40.64 0 bottom
R13  22.86,44.45 270 top
R14  20.32,38.1 90 top
R15  45.72,6.35 0 bottom
R16  41.91,6.35 0 bottom
STAT  26.67,44.45 180 top
Y1  50.8,15.24 270 top
Y2  24.13,8.89 180 bottom

### Tracks (layer width: path | path; a pad name or v marks a point on that pad's centre or on a via)
0CS0  (1 unrouted)
0MISO  (1 unrouted)
0MOSI  (1 unrouted)
0SCK  (2 unrouted)
3.3V  (21 unrouted)
  pour Top: 27.94,34.29 43.18,34.29 43.18,19.05 27.94,19.05
5V  (3 unrouted)
BL1  (1 unrouted)
BL2  (1 unrouted)
BL3  (1 unrouted)
BL4  (1 unrouted)
CAN1H  (2 unrouted)
CAN1L  (2 unrouted)
CAN1RX  (1 unrouted)
CAN1TX  (1 unrouted)
CAN2H  (2 unrouted)
CAN2L  (2 unrouted)
CAN2RX  (1 unrouted)
CAN2TX  (1 unrouted)
EXTAL32  (1 unrouted)
GND  (55 unrouted)
  pour Top: 0,56.77 0,0 53.34,0 53.34,56.77
  pour Bottom: 0,56.77 53.34,56.77 53.34,0 0,0
N$1  (1 unrouted)
N$2  (1 unrouted)
N$3  (1 unrouted)
N$4  (1 unrouted)
N$8  (1 unrouted)
N$9  (1 unrouted)
N$10  (4 unrouted)
N$11  (1 unrouted)
N$12  (1 unrouted)
N$13  (1 unrouted)
N$14  (1 unrouted)
N$19  (1 unrouted)
N$20  (1 unrouted)
N$21  (1 unrouted)
PRGM  (1 unrouted)
RESET  (2 unrouted)
SDCD  (2 unrouted)
USB0D+  (1 unrouted)
USB0D-  (1 unrouted)
USBD+  (3 unrouted)
USBD-  (3 unrouted)
VBAT  (2 unrouted)
VCC  (7 unrouted)
VDDA  (3 unrouted)
VREFH  (2 unrouted)
VSSA  (4 unrouted)